# EAGLE schematic main-unit-psu (EAGLE 9.6.2)
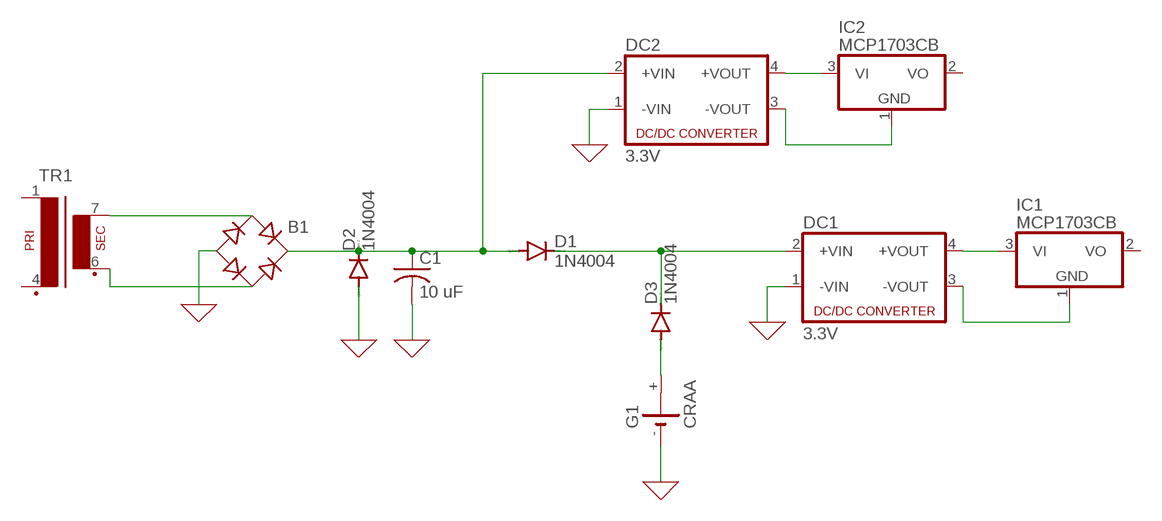
[diagram p0: schematic, sheet 1]

## Parts
B1  B-DIL  [B-DIL]
C1  10 uF  C-US050-024X044  [C050-024X044]
D1  1N4004  [DO41-10]
D2  1N4004  [DO41-10]
D3  1N4004  [DO41-10]
DC1  3.3V  NME  [NME]
DC2  3.3V  NME  [NME]
G1  CRAA  [CRAA]
IC1  MCP1703CB  [SOT23]
IC2  MCP1703CB  [SOT23]
TR1  EE20-1  [EE20-1]

## Nets
0: B1.- C1.2 D2.A DC1.1(-VIN) DC2.1(-VIN) G1.- ; supply symbol labelled GND
N$1: B1.AC1 TR1.7(S4)
N$2: B1.AC2 TR1.6(S3)
N$3: B1.+ C1.1 D1.A D2.C DC2.2(+VIN)
N$4: DC1.4(+VOUT) IC1.3(VI)
N$5: D1.C D3.C DC1.2(+VIN)
N$6: D3.A G1.+
N$7: DC1.3(-VOUT) IC1.1(GND)
N$9: DC2.4(+VOUT) IC2.3(VI)
N$10: DC2.3(-VOUT) IC2.1(GND)
Unconnected: G1.+@1(+) IC1.2(VO) IC2.2(VO) TR1.1 TR1.4(P2)

## Library data of the parts
B1 = rectifier:B-DIL: RECTIFIER; OC_NEWARK: unknown
C1 = rcl:C-US: CAPACITOR, American symbol; MF: KEMET; MPN: ESW106M025AC3AA; OC_NEWARK: 87AC8155; SPICEPREFIX: C
D1-D3 = diode:1N4004: DIODE general purpose rectifier, 1 A; MF: ONSEMI; MPN: 1N4004RLG; OC_NEWARK: 84K8827
DC1 DC2 = dc-dc-converter:NME: DC-DC CONVERTER; MF: MURATA POWER SOLUTIONS; MPN: CME0303S3C; OC_FARNELL: 1021466; OC_NEWARK: 29X1501
G1 = battery:CRAA: LI BATTERY Varta; OC_NEWARK: unknown
IC1 IC2 = linear:MCP1703: 250 mA, 16V, Low Quiescent Current LDO Regulator Source: http://ww1.microchip.com/downloads/en/DeviceDoc/22049b.pdf; OC_NEWARK: unknown
TR1 = trafo:EE20-1: TRANSFORMER 1 primary winding, 1 secondary winding ERA; MF: TRIAD MAGNETICS; MPN: TCT3-11E07AE; OC_NEWARK: 98M4353